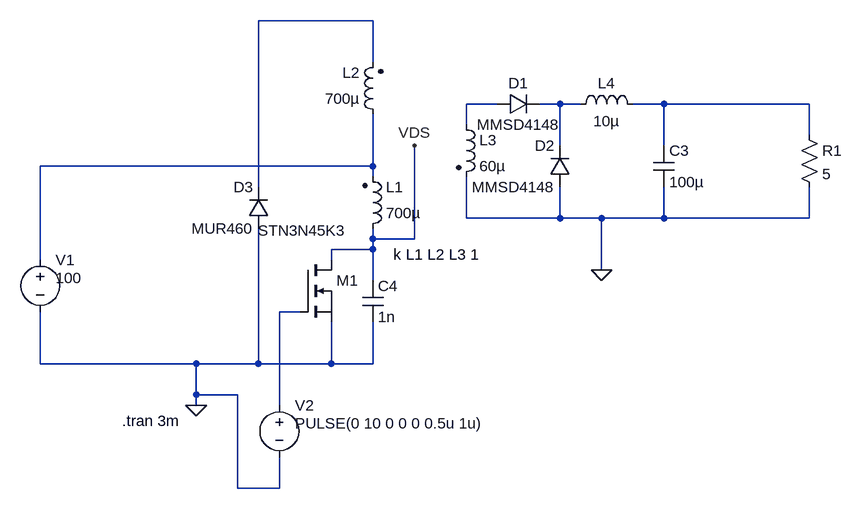
[diagram p0: schematic フォワードコンバータ.asc]
フォワードコンバータ.asc, the LTspice schematic file:
Version 4
SHEET 1 1068 680
WIRE 336 -240 160 -240
WIRE 336 -176 336 -240
WIRE 528 -112 480 -112
WIRE 624 -112 592 -112
WIRE 656 -112 624 -112
WIRE 784 -112 736 -112
WIRE 1008 -112 784 -112
WIRE 480 -80 480 -112
WIRE 1008 -64 1008 -112
WIRE 624 -48 624 -112
WIRE 784 -48 784 -112
WIRE 336 -16 336 -96
WIRE 336 -16 -176 -16
WIRE 336 0 336 -16
WIRE 160 16 160 -240
WIRE 480 64 480 0
WIRE 624 64 624 16
WIRE 624 64 480 64
WIRE 688 64 624 64
WIRE 784 64 784 16
WIRE 784 64 688 64
WIRE 1008 64 1008 16
WIRE 1008 64 784 64
WIRE 336 96 336 80
WIRE 400 96 400 -48
WIRE 400 96 336 96
WIRE 336 112 336 96
WIRE 336 112 272 112
WIRE -176 128 -176 -16
WIRE 272 128 272 112
WIRE 688 144 688 64
WIRE 336 160 336 112
WIRE 224 208 192 208
WIRE -176 288 -176 208
WIRE 64 288 -176 288
WIRE 160 288 160 80
WIRE 160 288 64 288
WIRE 272 288 272 224
WIRE 272 288 160 288
WIRE 336 288 336 224
WIRE 336 288 272 288
WIRE 64 336 64 288
WIRE 128 336 64 336
WIRE 64 352 64 336
WIRE 192 352 192 208
WIRE 128 480 128 336
WIRE 192 480 192 432
WIRE 192 480 128 480
FLAG 64 352 0
FLAG 688 144 0
FLAG 400 -48 VDS
SYMBOL voltage -176 112 R0
WINDOW 3 24 44 Left 2
WINDOW 123 0 0 Left 0
WINDOW 39 0 0 Left 0
SYMATTR InstName V1
SYMATTR Value 100
SYMBOL nmos 224 128 R0
WINDOW 3 -65 -45 Left 2
SYMATTR InstName M1
SYMATTR Value STN3N45K3
SYMBOL ind2 320 96 M180
WINDOW 0 36 80 Left 2
WINDOW 3 36 40 Left 2
SYMATTR InstName L1
SYMATTR Value 700µ
SYMATTR Type ind
SYMATTR SpiceLine Rser=1.7
SYMBOL ind2 464 -96 R0
SYMATTR InstName L3
SYMATTR Value 60µ
SYMATTR Type ind
SYMATTR SpiceLine Rser=0.5
SYMBOL ind 640 -96 R270
WINDOW 0 32 56 VTop 2
WINDOW 3 5 56 VBottom 2
SYMATTR InstName L4
SYMATTR Value 10µ
SYMATTR SpiceLine Rser=50m
SYMBOL diode 528 -96 R270
WINDOW 0 32 32 VTop 2
WINDOW 3 0 32 VBottom 2
SYMATTR InstName D1
SYMATTR Value MMSD4148
SYMBOL diode 640 16 R180
WINDOW 0 24 64 Left 2
WINDOW 3 24 0 Left 2
SYMATTR InstName D2
SYMATTR Value MMSD4148
SYMBOL res 992 -80 R0
SYMATTR InstName R1
SYMATTR Value 5
SYMBOL cap 768 -48 R0
SYMATTR InstName C3
SYMATTR Value 100µ
SYMATTR SpiceLine V=50 Rser=0.1
SYMBOL voltage 192 336 R0
WINDOW 3 24 44 Left 2
WINDOW 123 0 0 Left 0
WINDOW 39 0 0 Left 0
SYMATTR InstName V2
SYMATTR Value PULSE(0 10 0 0 0 0.5u 1u)
SYMBOL cap 320 160 R0
SYMATTR InstName C4
SYMATTR Value 1n
SYMATTR SpiceLine Rser=1000000
SYMBOL ind2 352 -80 R180
WINDOW 0 36 80 Left 2
WINDOW 3 36 40 Left 2
SYMATTR InstName L2
SYMATTR Value 700µ
SYMATTR Type ind
SYMATTR SpiceLine Rser=1
SYMBOL diode 176 80 R180
WINDOW 0 24 64 Left 2
WINDOW 3 24 0 Left 2
SYMATTR InstName D3
SYMATTR Value MUR460
TEXT -50 376 Left 2 !.tran 3m
TEXT 368 120 Left 2 !k L1 L2 L3 1

The netlist it stands for:
* フォワードコンバータ.asc
V1 N005 0 100
M1 VDS N006 0 0 STN3N45K3
L1 VDS N005 700µ Rser=1.7
L3 N002 0 60µ Rser=0.5
L4 N003 N004 10µ Rser=50m
D1 N002 N003 MMSD4148
D2 0 N003 MMSD4148
R1 N004 0 5
C3 N004 0 100µ V=50 Rser=0.1
V2 N006 0 PULSE(0 10 0 0 0 0.5u 1u)
C4 VDS 0 1n Rser=1000000
L2 N005 N001 700µ Rser=1
D3 0 N001 MUR460
.model D D
.lib standard.dio
.model NMOS NMOS
.model PMOS PMOS
.lib standard.mos
.tran 3m
k L1 L2 L3 1
.backanno
.end